# Altium schematic sheet 1_Power_Supply.SchDoc: Apalis Evaluation Board 1.1
size A3; Organization: Toradex AG; Address1: Altsagenstrasse 5; Address2: Horw; Address3: 6048; Address4: Switzerland; DocumentNumber: 3; Revision: V1.1; SheetNumber: 3; SheetTotal: 32; PageSetup: Record=PageOptions|CenterHorizontal=True|CenterVertical=True|PrintScale=0.73|XCorrection=1.00|YCorrection=1.00|PrintKind=0|BorderSize=5000000|LeftOffset=0|BottomOffset=0|Orientation=2|PaperLength=1000|PaperWidth=1000|Scale=100|PaperSource=7|PrintQuality=-4|MediaType=1|DitherType=10|PaperKind=A4|PrintScaleMode=1
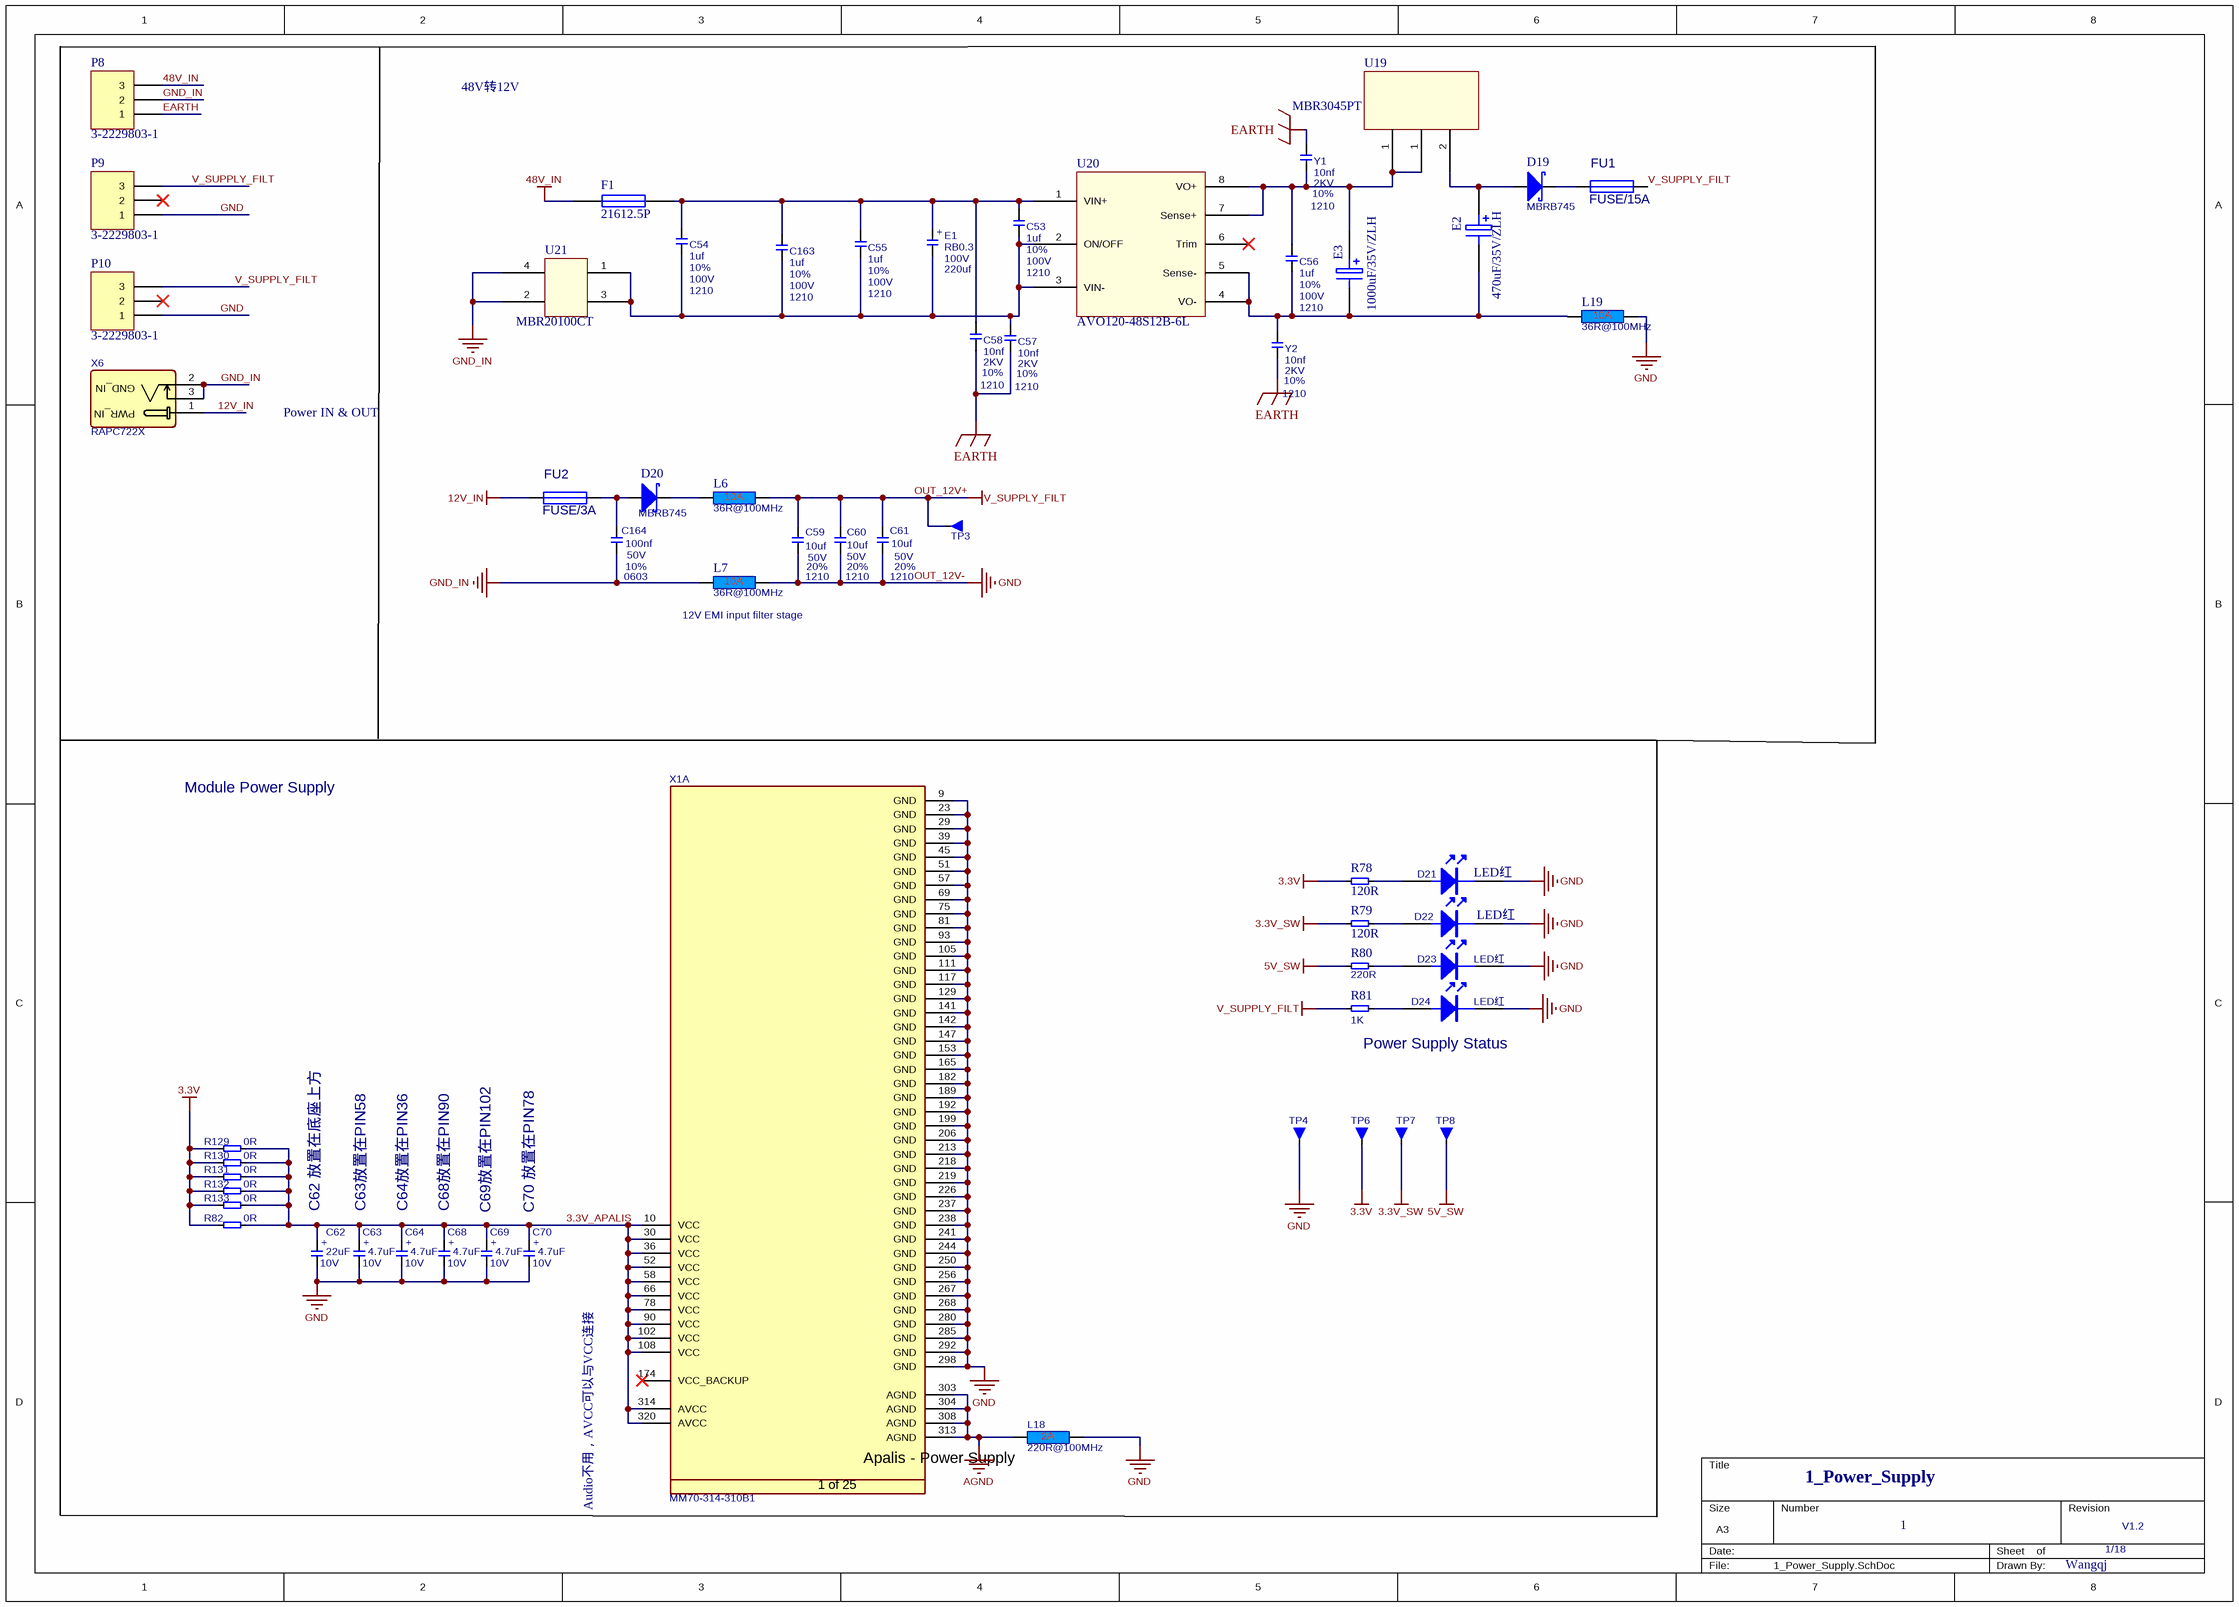
[diagram p0: 1_Power_Supply.SchDoc]

## Parts
C53  value 1uf  Tolerance: 10%  Rating: 100V  [1210]  (hidden comment: 1uf-100V-10%-1210)
C54  value 1uf  Tolerance: 10%  Rating: 100V  [1210]  (hidden comment: 1uf-100V-10%-1210)
C55  value 1uf  Tolerance: 10%  Rating: 100V  [1210]  (hidden comment: 1uf-100V-10%-1210)
C56  value 1uf  Tolerance: 10%  Rating: 100V  [1210]  (hidden comment: 1uf-100V-10%-1210)
C57  value 10nf  Tolerance: 10%  Rating: 2KV  [1210]  (hidden comment: 10nf-2KV-10%-1210)
C58  value 10nf  Tolerance: 10%  Rating: 2KV  [1210]  (hidden comment: 10nf-2KV-10%-1210)
C59  value 10uf  Tolerance: 20%  Rating: 50V  Footprint: 1210  [CAPC3225X160N]  (hidden comment: 10uf-50V-20%-1210-X5R)
C60  value 10uf  Tolerance: 20%  Rating: 50V  Footprint: 1210  [CAPC3225X160N]  (hidden comment: 10uf-50V-20%-1210-X5R)
C61  value 10uf  Tolerance: 20%  Rating: 50V  Footprint: 1210  [CAPC3225X160N]  (hidden comment: 10uf-50V-20%-1210-X5R)
C62  Rating: 10V  [CAPMP3528X210N]  (hidden comment: 22uF)
C63  Rating: 10V  [T_CAPMP3216X180N]  (hidden comment: 4.7uF)
C64  Rating: 10V  [T_CAPMP3216X180N]  (hidden comment: 4.7uF)
C68  Rating: 10V  [T_CAPMP3216X180N]  (hidden comment: 4.7uF)
C69  Rating: 10V  [T_CAPMP3216X180N]  (hidden comment: 4.7uF)
C70  Rating: 10V  [T_CAPMP3216X180N]  (hidden comment: 4.7uF)
C163  value 1uf  Tolerance: 10%  Rating: 100V  [1210]  (hidden comment: 1uf-100V-10%-1210)
C164  value 100nf  Tolerance: 10%  Rating: 50V  Footprint: 0603  [T_CAPC0603X33N]  (hidden comment: 100nf-50V-10%-0603-X7R)
D19  Manufacturer Part No.: MBRB745  [T_VISHAY_MBRB735PBF]  (hidden comment: MBRB735PBF)
D20  MBRB745  [T_VISHAY_MBRB735PBF]
D21  LED红  [LC-0805_LED_S3]
D22  LED红  [LC-0805_LED_S3]
D23  LED红  [LC-0805_LED_S3]
D24  LED红  [LC-0805_LED_S3]
E1  value 220uf  Footprint: RB0.3  Rating: 100V  [5*13]  (hidden comment: 220uf-100V-RB0.3)
E2  470uF/35V/ZLH  [RB0.3]
E3  1000uF/35V/ZLH  [5*13]
F1  21612.5P  [RAD0.3]
FU1  FUSE/15A  [FUSE-1808-3A]
FU2  FUSE/3A  [FUSE-1808-3A]
L6  36R@100MHz  [T_Laird_35F0121-0SR-10]
L7  36R@100MHz  [T_Laird_35F0121-0SR-10]
L18  220R@100MHz  [INDC1608X95N]
L19  36R@100MHz  [T_Laird_35F0121-0SR-10]
P8  3-2229803-1  [3-2229803-1]
P9  3-2229803-1  [3-2229803-1]
P10  3-2229803-1  [3-2229803-1]
R78  120R  [T_RESC0603X30N]
R79  120R  [T_RESC0603X30N]
R80  220R  [T_RESC0603X30N]
R81  1K  [T_RESC0603X30N]
R82  0R  [T_RESC3216X760N]
R129  0R  [T_RESC3216X760N]
R130  0R  [T_RESC3216X760N]
R131  0R  [T_RESC3216X760N]
R132  0R  [T_RESC3216X760N]
R133  0R  [T_RESC3216X760N]
TP3  Testpin  [T_TP-THT]  (value not drawn)
TP4  Testpin  [T_TP-THT]  (value not drawn)
TP6  Testpin  [T_TP-THT]  (value not drawn)
TP7  Testpin  [T_TP-THT]  (value not drawn)
TP8  Testpin  [T_TP-THT]  (value not drawn)
U19  MBR3045PT  [TO-3P]
U20  AVO120-48S12B-6L  [AVO120-48S12B-6L]
U21  MBR20100CT  [TO-220]
X1  Manufacturer Part No.: MM70-314-310B1  [T_JAE_MM70-314-310B1]  (hidden comment: CON-JAE-MM70-314-310B1-314-0.5mm)  (part A of 25)
X6  RAPC722X  [DC-005]
Y1  value 10nf  Tolerance: 10%  Rating: 2KV  [1210]  (hidden comment: 10nf-2KV-10%-1210)
Y2  value 10nf  Tolerance: 10%  Rating: 2KV  [1210]  (hidden comment: 10nf-2KV-10%-1210)

## Nets
3.3V: R78.1 R82.1 R129.1 R130.1 R131.1 R132.1 R133.1 TP6.1
3.3V_SW: R79.1 TP7.1
5V_SW: R80.1 TP8.1
12V_IN: FU2.1 X6.1(GND_IN)
48V_IN: F1.1 P8.3
AGND: L18.1 X1.303(AGND) X1.304(AGND) X1.308(AGND) X1.313(AGND)
EARTH: C57.1 C58.1 P8.1 Y1.2 Y2.1
GND: C59.1 C60.1 C61.1 C62.2 C63.2 C64.2 C68.2 C69.2 C70.2 D21.K D22.K D23.K D24.K L7.2 L18.2 L19.2 P9.1 P10.1 TP4.1 X1.9(GND) X1.23(GND) X1.29(GND) X1.39(GND) X1.45(GND) X1.51(GND) X1.57(GND) X1.69(GND) X1.75(GND) X1.81(GND) X1.93(GND) X1.105(GND) X1.111(GND) X1.117(GND) X1.129(GND) X1.141(GND) X1.142(GND) X1.147(GND) X1.153(GND) X1.165(GND) X1.182(GND) X1.189(GND) X1.192(GND) X1.199(GND) X1.206(GND) X1.213(GND) X1.218(GND) X1.219(GND) X1.226(GND) X1.237(GND) X1.238(GND) X1.241(GND) X1.244(GND) X1.250(GND) X1.256(GND) X1.267(GND) X1.268(GND) X1.280(GND) X1.285(GND) X1.292(GND) X1.298(GND)  [also labelled OUT_12V-]
GND_IN: C164.1 L7.1 P8.2 U21.2 U21.4 X6.2(PWR_IN) X6.3(PWR_IN)
OUT_12V+: C59.2 C60.2 C61.2 FU1.2 L6.2 P9.3 P10.3 R81.1 TP3.1  [also labelled V_SUPPLY_FILT]
3.3V_APALIS: C62.1 C63.1 C64.1 C68.1 C69.1 C70.1 R82.2 R129.2 R130.2 R131.2 R132.2 R133.2 X1.10(VCC) X1.30(VCC) X1.36(VCC) X1.52(VCC) X1.58(VCC) X1.66(VCC) X1.78(VCC) X1.90(VCC) X1.102(VCC) X1.108(VCC) X1.314(AVCC) X1.320(AVCC)
NetC53_1: C53.1 C54.1 C55.1 C57.2 C163.1 E1.2 U20.2(ON/OFF) U20.3(VIN-) U21.1 U21.3
NetC53_2: C53.2 C54.2 C55.2 C58.2 C163.2 E1.1 F1.2 U20.1(VIN+)
NetC56_1: C56.1 E2.2 E3.2 L19.1 U20.4(VO-) U20.5(Sense-) Y2.2
NetC56_2: C56.2 E3.1 U19.1 U20.7(Sense+) U20.8(VO+) Y1.1
NetC164_2: C164.2 D20.3 FU2.2
NetD19_2: D19.2 FU1.1
NetD19_3: D19.3 E2.1 U19.2
NetD20_2: D20.2 L6.1
NetD21_A: D21.A R78.2
NetD22_A: D22.A R79.2
NetD23_A: D23.A R80.2
NetD24_A: D24.A R81.2

Not connected (* = marked no-connect by the designer): P9 2*; P10 2*; U20 6(Trim)*; X1 174(VCC_BACKUP)*

## Notes on the sheet
- 48V转12V
- Power IN & OUT
- (near L7) 12V EMI input filter stage
- Module Power Supply
- Power Supply Status
- C62 放置在底座上方
- C63放置在PIN58
- C64放置在PIN36
- C68放置在PIN90
- C69放置在PIN102
- C70 放置在PIN78
- 1_Power_Supply
- Audio不用，AVCC可以与VCC连接
- 1
- 1/18
- V1.2
- Wangqj
- Title
- Size:
- Date:
- A3
- Number:
- Time:
- Revision:
- Sheet
- of
- File:
- (in symbol C-TA) +
- (in symbol C-TA-4.7uF-10V-20%-3216) +
- (in symbol C-TA-22uF-10V-20%-3528) +
- (in symbol CON-JAE-MM70-314-310B1-314-0.5mm, part A) Apalis - Power Supply; 1 of 25

## Library data of the parts
C53-C58 C163 = C-Ceramic: 33pf-50V-5%-0603; Type: X7R
C59-C61 = C-10uF-50V-20%-1210-X5R: Capacitor Ceramic X5R 10uF 50V 20% 1210; Type: X5R
C62 = C-TA-22uF-10V-20%-3528: Capacitor TA 22uF 10V 20% 3528; Tolerance: 20%; Type: TA; Value: 22uF
C63 C64 C68-C70 = C-TA-4.7uF-10V-20%-3216: Capacitor TA 4.7uF 10V 20% 3216; Tolerance: 20%; Type: TA; Value: 4.7uF
C164 = C-100nF-50V-20%-0603-X7R: Capacitor Ceramic X7R 100nF 50V 20% 0603; Type: X7R
D19 D20 = D-VISHAY-MBRB735PBF: MBRB735PBF Schottky Diode; Manufacturer Name: Vishay
  D20: Manufacturer Part No.: MBRB745
D21-D24 = LED: 0805LED红
E1 = C-TA: Capacitor TA; Tolerance: 20%; Type: TA
E2 E3 = ELECTRO1: 插装电解电容
F1 = FUSE1: 直插12.5A保险丝
FU1 = FUSE: 贴片15A保险
FU2 = FUSE: 贴片3A保险
L6 L7 L19 = L-Laird-35F0121-0SR-10-10A-25%: Power Supply FB 10A; Tolerance: 25%; Rating: 10A; Value: 36R@100MHz
L18 = L-220R@100MHz-2A-25%-0603: 220R@100MHz 2A EMI FILTER; Tolerance: 25%; Rating: 2A; Value: 220R@100MHz
P8-P10 = Header 3: 泰科电源端子座; LatestRevisionDate: 17-Jul-2002; LatestRevisionNote: Re-released for DXP Platform.; Publisher: Altium Limited
R78 R79 = R-120R-63mW-5%-0603: Resistor 120 ohm 63mW 5% 0603; Rating: 63mW; Tolerance: 5%; Value: 120R
R80 = R-220R-63mW-5%-0603: Resistor 220 ohm 63mW 5% 0603; Rating: 63mW; Tolerance: 5%; Value: 220R
R81 = R-1KR-63mW-5%-0603: Resistor 1 Kohm 63mW 5% 0603; Rating: 63mW; Tolerance: 5%; Value: 1K
R82 = R-0R-63mW-1%-1206: Resistor 0 ohm 330mW 1% 1206; Rating: 63mW; Tolerance: 1%; Value: 0R
R129-R133 = R-0R-63mW-1%-1206: Resistor 0 ohm 63mW 1% 1206; Rating: 63mW; Tolerance: 1%; Value: 0R
TP3 TP4 TP6-TP8 = Testpin: Testpin TH
U19 = MBR3045T: 插装肖特基二极管，加散热片
U20 = AVO120-48S12B-6L: 嵌入式48-12V电源模块
X1 = CON-JAE-MM70-314-310B1-314-0.5mm: MXM3 Connector; Manufacturer Name: JAE; No. of ways: 314
X6 = CON-SWC-RAPC722X: Power Jack; Manufacturer Name: SWC; Manufacturer Part No.: RAPC722X
Y1 Y2 = C-Ceramic: 33pf-50V-5%-0603; Type: X7R